# Altium project 2016_FDP.PrjPcb (part 2 of 2)

## Sheet 2016_FDP_ACTIONNEUR.SchDoc
size A2
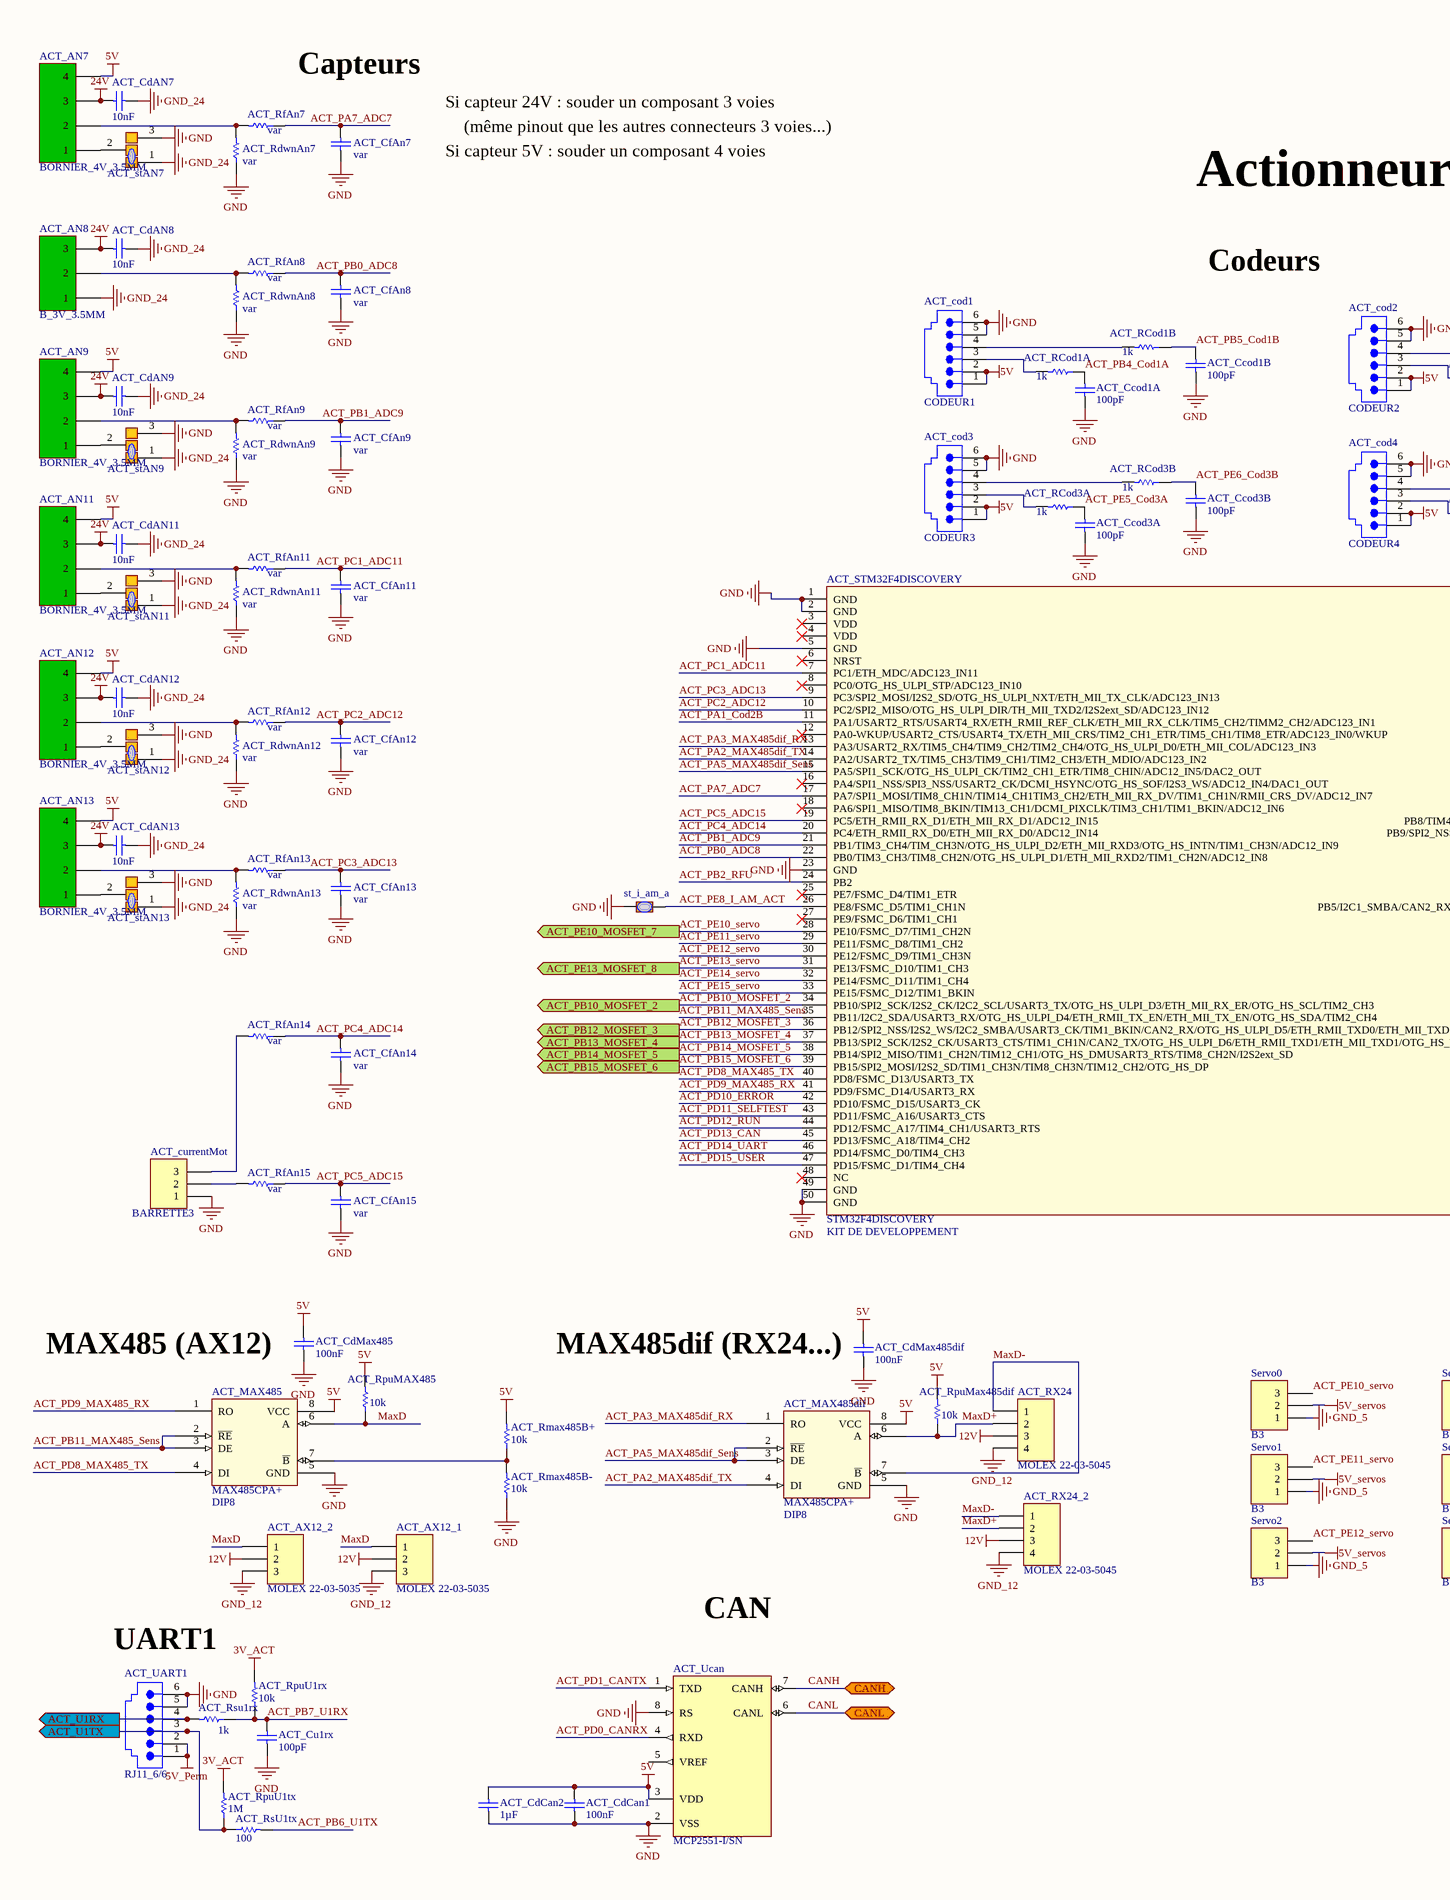
[diagram p5: 2016_FDP_ACTIONNEUR.SchDoc, left]
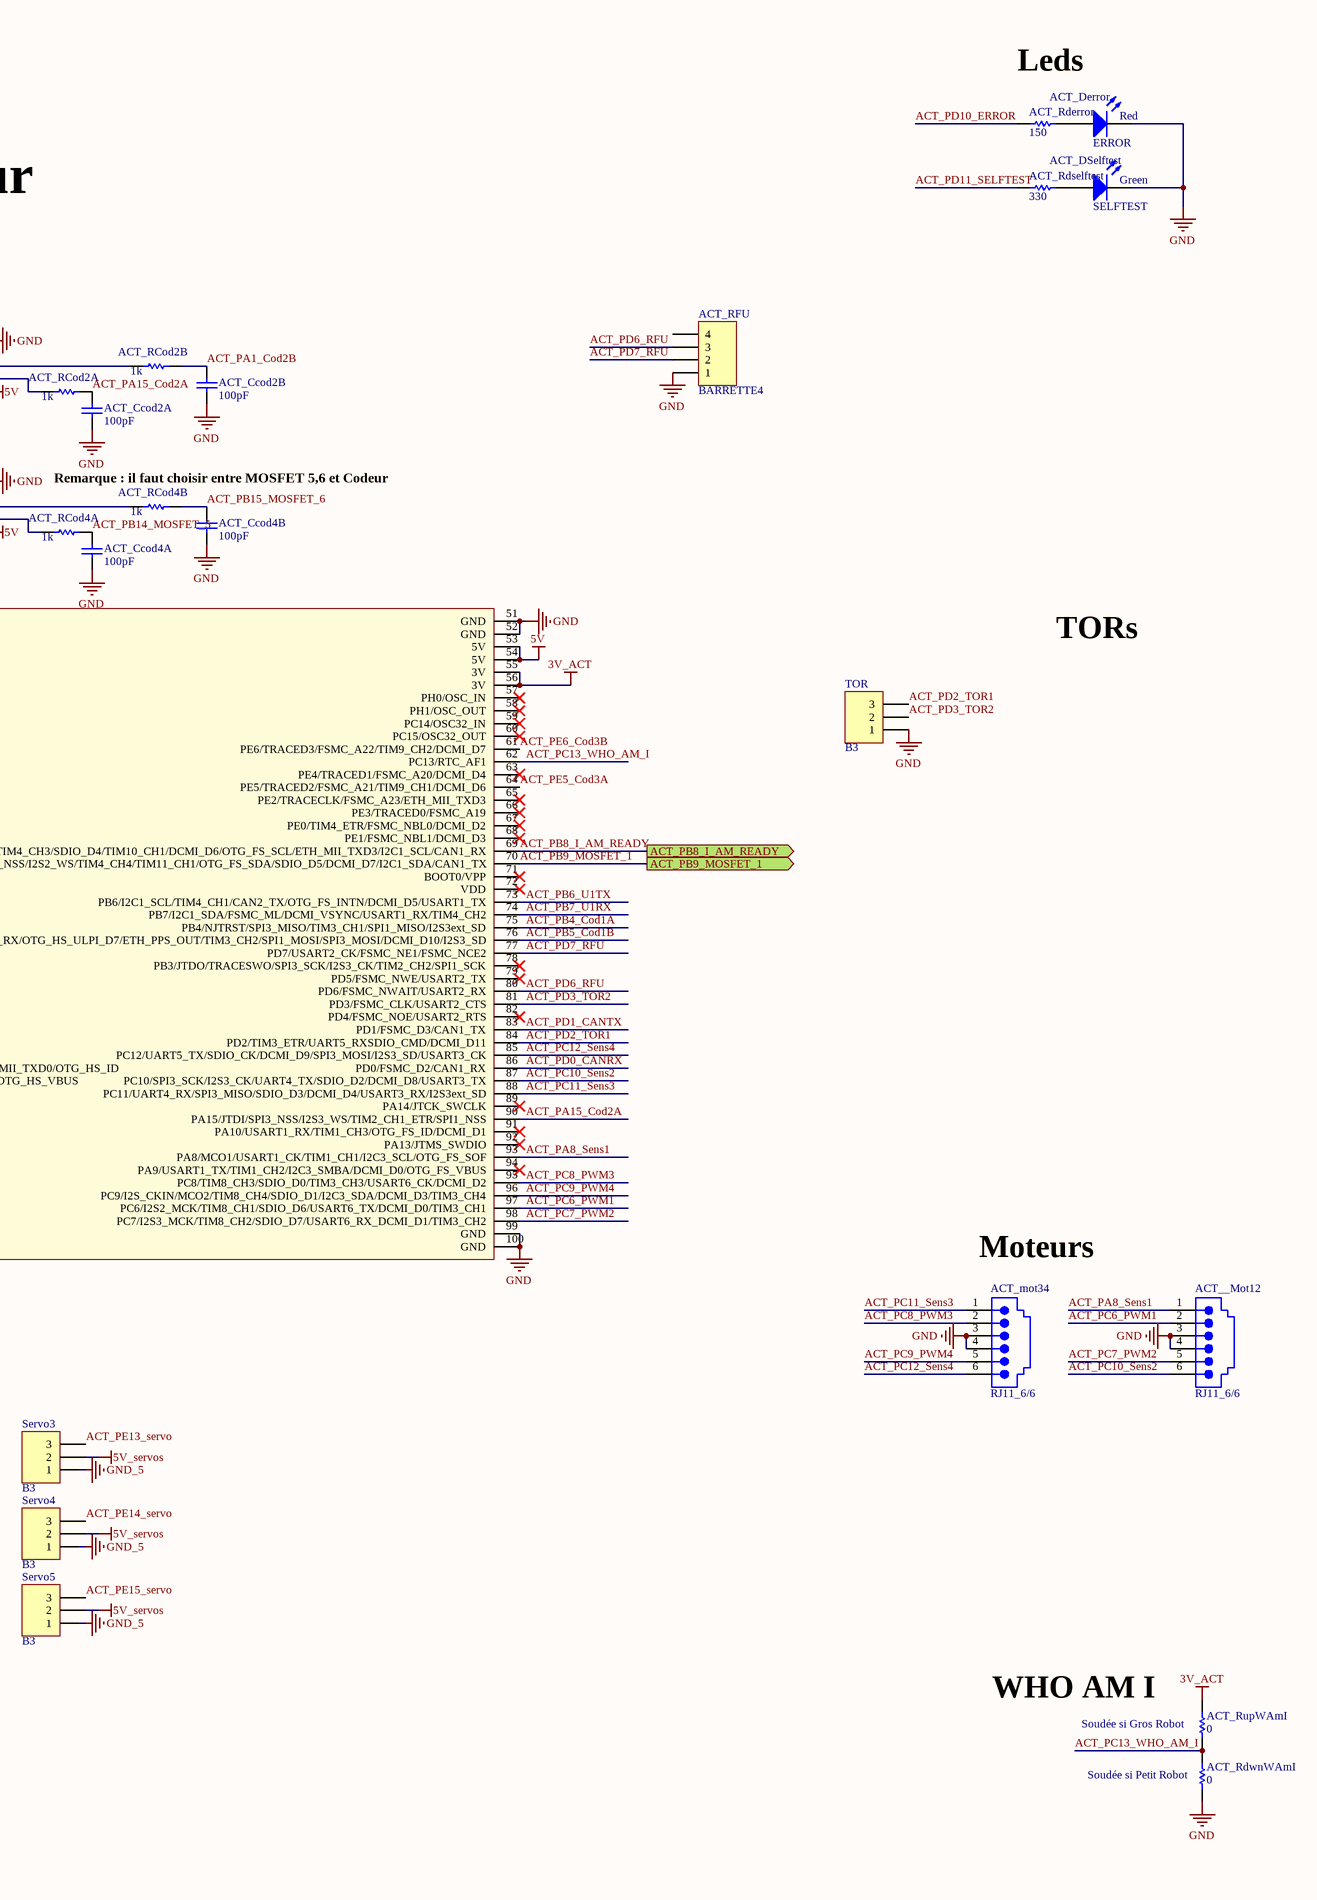
[diagram p6: 2016_FDP_ACTIONNEUR.SchDoc, right]

### Parts
ACT__Mot12  RJ11_6/6  [RJ11_6/6 - droit]
ACT_AN7  BORNIER_4V_3.5MM  [BORNIER_4V_3.5MM]
ACT_AN8  B_3V_3.5MM  [BORNIER_3V_3.5MM]
ACT_AN9  BORNIER_4V_3.5MM  [BORNIER_4V_3.5MM]
ACT_AN11  BORNIER_4V_3.5MM  [BORNIER_4V_3.5MM]
ACT_AN12  BORNIER_4V_3.5MM  [BORNIER_4V_3.5MM]
ACT_AN13  BORNIER_4V_3.5MM  [BORNIER_4V_3.5MM]
ACT_AX12_1  MOLEX 22-03-5035  [MOLEX3_2.5MM]
ACT_AX12_2  MOLEX 22-03-5035  [MOLEX3_2.5MM]
ACT_Ccod1A  100pF  [C0805_N]
ACT_Ccod1B  100pF  [C0805_N]
ACT_Ccod2A  100pF  [C0805_N]
ACT_Ccod2B  100pF  [C0805_N]
ACT_Ccod3A  100pF  [C0805_N]
ACT_Ccod3B  100pF  [C0805_N]
ACT_Ccod4A  100pF  [C0805_N]
ACT_Ccod4B  100pF  [C0805_N]
ACT_CdAN7  10nF  [C0805_N]
ACT_CdAN8  10nF  [C0805_N]
ACT_CdAN9  10nF  [C0805_N]
ACT_CdAN11  10nF  [C0805_N]
ACT_CdAN12  10nF  [C0805_N]
ACT_CdAN13  10nF  [C0805_N]
ACT_CdCan1  100nF  [C0805_N]
ACT_CdCan2  1µF  [C0805_N]
ACT_CdMax485  100nF  [C0805_N]
ACT_CdMax485dif  100nF  [C0805_N]
ACT_CfAn7  var  [C0805_N]
ACT_CfAn8  var  [C0805_N]
ACT_CfAn9  var  [C0805_N]
ACT_CfAn11  var  [C0805_N]
ACT_CfAn12  var  [C0805_N]
ACT_CfAn13  var  [C0805_N]
ACT_CfAn14  var  [C0805_N]
ACT_CfAn15  var  [C0805_N]
ACT_cod1  CODEUR1  [RJ11_6/6 - droit]
ACT_cod2  CODEUR2  [RJ11_6/6 - droit]
ACT_cod3  CODEUR3  [RJ11_6/6 - droit]
ACT_cod4  CODEUR4  [RJ11_6/6 - droit]
ACT_Cu1rx  100pF  [C0805_N]
ACT_currentMot  BARRETTE3  [HE14_3]
ACT_Derror  ERROR  [LED_0805]
ACT_DSelftest  SELFTEST  [LED_0805]
ACT_MAX485  Type: MAX485CPA+  Package: DIP8  [SO8_N]  (hidden comment: MAX485CPA+_DIP8)
ACT_MAX485dif  Type: MAX485CPA+  Package: DIP8  [SO8_N]  (hidden comment: MAX485CPA+_DIP8)
ACT_mot34  RJ11_6/6  [RJ11_6/6 - droit]
ACT_RCod1A  1k  [R1206_N]
ACT_RCod1B  1k  [R1206_N]
ACT_RCod2A  1k  [R1206_N]
ACT_RCod2B  1k  [R1206_N]
ACT_RCod3A  1k  [R1206_N]
ACT_RCod3B  1k  [R1206_N]
ACT_RCod4A  1k  [R1206_N]
ACT_RCod4B  1k  [R1206_N]
ACT_Rderror  150  [R1206_N]
ACT_Rdselftest  330  [R1206_N]
ACT_RdwnAn7  var  [R1206_N]
ACT_RdwnAn8  var  [R1206_N]
ACT_RdwnAn9  var  [R1206_N]
ACT_RdwnAn11  var  [R1206_N]
ACT_RdwnAn12  var  [R1206_N]
ACT_RdwnAn13  var  [R1206_N]
ACT_RdwnWAmI  0  [R1206_N]
ACT_RfAn7  var  [R1206_N]
ACT_RfAn8  var  [R1206_N]
ACT_RfAn9  var  [R1206_N]
ACT_RfAn11  var  [R1206_N]
ACT_RfAn12  var  [R1206_N]
ACT_RfAn13  var  [R1206_N]
ACT_RfAn14  var  [R1206_N]
ACT_RfAn15  var  [R1206_N]
ACT_RFU  BARRETTE4  [HE14_4]
ACT_Rmax485B+  10k  [R1206_N]
ACT_Rmax485B-  10k  [R1206_N]
ACT_RpuMAX485  10k  [R1206_N]
ACT_RpuMax485dif  10k  [R1206_N]
ACT_RpuU1rx  10k  [R1206_N]
ACT_RpuU1tx  1M  [R1206_N]
ACT_Rsu1rx  1k  [R1206_N]
ACT_RsU1tx  100  [R1206_N]
ACT_RupWAmI  0  [R1206_N]
ACT_RX24  MOLEX 22-03-5045  [MOLEX4_2.5MM]
ACT_RX24_2  MOLEX 22-03-5045  [MOLEX4_2.5MM]
ACT_stAN7  strap  [Goutte Strap_3]  (value not drawn)
ACT_stAN9  strap  [Goutte Strap_3]  (value not drawn)
ACT_stAN11  strap  [Goutte Strap_3]  (value not drawn)
ACT_stAN12  strap  [Goutte Strap_3]  (value not drawn)
ACT_stAN13  strap  [Goutte Strap_3]  (value not drawn)
ACT_STM32F4DISCOVERY  STM32F4DISCOVERY  Type: KIT DE DEVELOPPEMENT  [STM32_F4DISCOVERY]
ACT_UART1  RJ11_6/6  [RJ11_6/6 - droit]
ACT_Ucan  MCP2551-I/SN  [SO8_N]
Servo0  B3  [HE14_3]
Servo1  B3  [HE14_3]
Servo2  B3  [HE14_3]
Servo3  B3  [HE14_3]
Servo4  B3  [HE14_3]
Servo5  B3  [HE14_3]
st_i_am_a  Goutte Strap_2  [Goutte Strap_2 Pads_Clearance 0.254mm]  (value not drawn)
TOR  B3  [HE14_3]

### Ports
ACT_PB8_I_AM_READY (out), ACT_PB9_MOSFET_1 (out), ACT_PB10_MOSFET_2 (out), ACT_PB12_MOSFET_3 (out), ACT_PB13_MOSFET_4 (out), ACT_PB14_MOSFET_5 (out), ACT_PB15_MOSFET_6 (out), ACT_PE10_MOSFET_7 (out), ACT_PE13_MOSFET_8 (out), ACT_U1RX (out), ACT_U1TX (out), CANH (bidir), CANL (bidir)

### Nets
3V_ACT: ACT_RpuU1rx.2 ACT_RpuU1tx.2 ACT_RupWAmI.2 ACT_STM32F4DISCOVERY.55(3V) ACT_STM32F4DISCOVERY.56(3V)
5V: ACT_AN7.4 ACT_AN9.4 ACT_AN11.4 ACT_AN12.4 ACT_AN13.4 ACT_CdCan1.2 ACT_CdCan2.2 ACT_CdMax485.2 ACT_CdMax485dif.2 ACT_cod1.1 ACT_cod1.2 ACT_cod2.1 ACT_cod2.2 ACT_cod3.1 ACT_cod3.2 ACT_cod4.1 ACT_cod4.2 ACT_MAX485.8(VCC) ACT_MAX485dif.8(VCC) ACT_Rmax485B+.2 ACT_RpuMAX485.2 ACT_RpuMax485dif.2 ACT_STM32F4DISCOVERY.53(5V) ACT_STM32F4DISCOVERY.54(5V) ACT_Ucan.3(VDD)
5V_Perm: ACT_UART1.1 ACT_UART1.2
5V_servos: Servo0.2 Servo1.2 Servo2.2 Servo3.2 Servo4.2 Servo5.2
12V: ACT_AX12_1.2 ACT_AX12_2.2 ACT_RX24.3 ACT_RX24_2.3
24V: ACT_AN7.3 ACT_AN8.3 ACT_AN9.3 ACT_AN11.3 ACT_AN12.3 ACT_AN13.3 ACT_CdAN7.2 ACT_CdAN8.2 ACT_CdAN9.2 ACT_CdAN11.2 ACT_CdAN12.2 ACT_CdAN13.2
GND: ACT__Mot12.3 ACT__Mot12.4 ACT_Ccod1A.1 ACT_Ccod1B.1 ACT_Ccod2A.1 ACT_Ccod2B.1 ACT_Ccod3A.1 ACT_Ccod3B.1 ACT_Ccod4A.1 ACT_Ccod4B.1 ACT_CdCan1.1 ACT_CdCan2.1 ACT_CdMax485.1 ACT_CdMax485dif.1 ACT_CfAn7.1 ACT_CfAn8.1 ACT_CfAn9.1 ACT_CfAn11.1 ACT_CfAn12.1 ACT_CfAn13.1 ACT_CfAn14.1 ACT_CfAn15.1 ACT_cod1.5 ACT_cod1.6 ACT_cod2.5 ACT_cod2.6 ACT_cod3.5 ACT_cod3.6 ACT_cod4.5 ACT_cod4.6 ACT_Cu1rx.1 ACT_currentMot.1 ACT_Derror.2(K) ACT_DSelftest.2(K) ACT_MAX485.5(GND) ACT_MAX485dif.5(GND) ACT_mot34.3 ACT_mot34.4 ACT_RdwnAn7.1 ACT_RdwnAn8.1 ACT_RdwnAn9.1 ACT_RdwnAn11.1 ACT_RdwnAn12.1 ACT_RdwnAn13.1 ACT_RdwnWAmI.1 ACT_RFU.1 ACT_Rmax485B-.1 ACT_stAN7.3 ACT_stAN9.3 ACT_stAN11.3 ACT_stAN12.3 ACT_stAN13.3 ACT_STM32F4DISCOVERY.1(GND) ACT_STM32F4DISCOVERY.2(GND) ACT_STM32F4DISCOVERY.5(GND) ACT_STM32F4DISCOVERY.23(GND) ACT_STM32F4DISCOVERY.49(GND) ACT_STM32F4DISCOVERY.50(GND) ACT_STM32F4DISCOVERY.51(GND) ACT_STM32F4DISCOVERY.52(GND) ACT_STM32F4DISCOVERY.99(GND) ACT_STM32F4DISCOVERY.100(GND) ACT_UART1.5 ACT_UART1.6 ACT_Ucan.2(VSS) ACT_Ucan.8(RS) st_i_am_a.1 TOR.1
GND_5: Servo0.1 Servo1.1 Servo2.1 Servo3.1 Servo4.1 Servo5.1
GND_12: ACT_AX12_1.3 ACT_AX12_2.3 ACT_RX24.4 ACT_RX24_2.4
GND_24: ACT_AN8.1 ACT_CdAN7.1 ACT_CdAN8.1 ACT_CdAN9.1 ACT_CdAN11.1 ACT_CdAN12.1 ACT_CdAN13.1 ACT_stAN7.1 ACT_stAN9.1 ACT_stAN11.1 ACT_stAN12.1 ACT_stAN13.1
ACT_PA1_Cod2B: ACT_Ccod2B.2 ACT_RCod2B.1 ACT_STM32F4DISCOVERY.11(PA1/USART2_RTS/USART4_RX/ETH_RMII_REF_CLK/ETH_MII_RX_CLK/TIM5_CH2/TIMM2_CH2/ADC123_IN1)
ACT_PA2_MAX485dif_TX: ACT_MAX485dif.4(DI) ACT_STM32F4DISCOVERY.14(PA2/USART2_TX/TIM5_CH3/TIM9_CH1/TIM2_CH3/ETH_MDIO/ADC123_IN2)
ACT_PA3_MAX485dif_RX: ACT_MAX485dif.1(RO) ACT_STM32F4DISCOVERY.13(PA3/USART2_RX/TIM5_CH4/TIM9_CH2/TIM2_CH4/OTG_HS_ULPI_D0/ETH_MII_COL/ADC123_IN3)
ACT_PA5_MAX485dif_Sens: ACT_MAX485dif.2(~{RE}) ACT_MAX485dif.3(DE) ACT_STM32F4DISCOVERY.15(PA5/SPI1_SCK/OTG_HS_ULPI_CK/TIM2_CH1_ETR/TIM8_CHIN/ADC12_IN5/DAC2_OUT)
ACT_PA7_ADC7: ACT_CfAn7.2 ACT_RfAn7.1 ACT_STM32F4DISCOVERY.17(PA7/SPI1_MOSI/TIM8_CH1N/TIM14_CH1TIM3_CH2/ETH_MII_RX_DV/TIM1_CH1N/RMII_CRS_DV/ADC12_IN7)
ACT_PA8_Sens1: ACT__Mot12.1 ACT_STM32F4DISCOVERY.93(PA8/MCO1/USART1_CK/TIM1_CH1/I2C3_SCL/OTG_FS_SOF)
ACT_PA15_Cod2A: ACT_Ccod2A.2 ACT_RCod2A.1 ACT_STM32F4DISCOVERY.90(PA15/JTDI/SPI3_NSS/I2S3_WS/TIM2_CH1_ETR/SPI1_NSS)
ACT_PB0_ADC8: ACT_CfAn8.2 ACT_RfAn8.1 ACT_STM32F4DISCOVERY.22(PB0/TIM3_CH3/TIM8_CH2N/OTG_HS_ULPI_D1/ETH_MII_RXD2/TIM1_CH2N/ADC12_IN8)
ACT_PB1_ADC9: ACT_CfAn9.2 ACT_RfAn9.1 ACT_STM32F4DISCOVERY.21(PB1/TIM3_CH4/TIM_CH3N/OTG_HS_ULPI_D2/ETH_MII_RXD3/OTG_HS_INTN/TIM1_CH3N/ADC12_IN9)
ACT_PB2_RFU: ACT_STM32F4DISCOVERY.24(PB2)
ACT_PB4_Cod1A: ACT_Ccod1A.2 ACT_RCod1A.1 ACT_STM32F4DISCOVERY.75(PB4/NJTRST/SPI3_MISO/TIM3_CH1/SPI1_MISO/I2S3ext_SD)
ACT_PB5_Cod1B: ACT_Ccod1B.2 ACT_RCod1B.1 ACT_STM32F4DISCOVERY.76(PB5/I2C1_SMBA/CAN2_RX/OTG_HS_ULPI_D7/ETH_PPS_OUT/TIM3_CH2/SPI1_MOSI/SPI3_MOSI/DCMI_D10/I2S3_SD)
ACT_PB6_U1TX: ACT_RsU1tx.2 ACT_STM32F4DISCOVERY.73(PB6/I2C1_SCL/TIM4_CH1/CAN2_TX/OTG_FS_INTN/DCMI_D5/USART1_TX)
ACT_PB7_U1RX: ACT_Cu1rx.2 ACT_RpuU1rx.1 ACT_Rsu1rx.1 ACT_STM32F4DISCOVERY.74(PB7/I2C1_SDA/FSMC_ML/DCMI_VSYNC/USART1_RX/TIM4_CH2)
ACT_PB8_I_AM_READY: ACT_STM32F4DISCOVERY.69(PB8/TIM4_CH3/SDIO_D4/TIM10_CH1/DCMI_D6/OTG_FS_SCL/ETH_MII_TXD3/I2C1_SCL/CAN1_RX) ; port ACT_PB8_I_AM_READY
ACT_PB9_MOSFET_1: ACT_STM32F4DISCOVERY.70(PB9/SPI2_NSS/I2S2_WS/TIM4_CH4/TIM11_CH1/OTG_FS_SDA/SDIO_D5/DCMI_D7/I2C1_SDA/CAN1_TX) ; port ACT_PB9_MOSFET_1
ACT_PB10_MOSFET_2: ACT_STM32F4DISCOVERY.34(PB10/SPI2_SCK/I2S2_CK/I2C2_SCL/USART3_TX/OTG_HS_ULPI_D3/ETH_MII_RX_ER/OTG_HS_SCL/TIM2_CH3) ; port ACT_PB10_MOSFET_2
ACT_PB11_MAX485_Sens: ACT_MAX485.2(~{RE}) ACT_MAX485.3(DE) ACT_STM32F4DISCOVERY.35(PB11/I2C2_SDA/USART3_RX/OTG_HS_ULPI_D4/ETH_RMII_TX_EN/ETH_MII_TX_EN/OTG_HS_SDA/TIM2_CH4)
ACT_PB12_MOSFET_3: ACT_STM32F4DISCOVERY.36(PB12/SPI2_NSS/I2S2_WS/I2C2_SMBA/USART3_CK/TIM1_BKIN/CAN2_RX/OTG_HS_ULPI_D5/ETH_RMII_TXD0/ETH_MII_TXD0/OTG_HS_ID) ; port ACT_PB12_MOSFET_3
ACT_PB13_MOSFET_4: ACT_STM32F4DISCOVERY.37(PB13/SPI2_SCK/I2S2_CK/USART3_CTS/TIM1_CH1N/CAN2_TX/OTG_HS_ULPI_D6/ETH_RMII_TXD1/ETH_MII_TXD1/OTG_HS_VBUS) ; port ACT_PB13_MOSFET_4
ACT_PB14_MOSFET_5: ACT_Ccod4A.2 ACT_RCod4A.1 ACT_STM32F4DISCOVERY.38(PB14/SPI2_MISO/TIM1_CH2N/TIM12_CH1/OTG_HS_DMUSART3_RTS/TIM8_CH2N/I2S2ext_SD) ; port ACT_PB14_MOSFET_5
ACT_PB15_MOSFET_6: ACT_Ccod4B.2 ACT_RCod4B.1 ACT_STM32F4DISCOVERY.39(PB15/SPI2_MOSI/I2S2_SD/TIM1_CH3N/TIM8_CH3N/TIM12_CH2/OTG_HS_DP) ; port ACT_PB15_MOSFET_6
ACT_PC1_ADC11: ACT_CfAn11.2 ACT_RfAn11.1 ACT_STM32F4DISCOVERY.7(PC1/ETH_MDC/ADC123_IN11)
ACT_PC2_ADC12: ACT_CfAn12.2 ACT_RfAn12.1 ACT_STM32F4DISCOVERY.10(PC2/SPI2_MISO/OTG_HS_ULPI_DIR/TH_MII_TXD2/I2S2ext_SD/ADC123_IN12)
ACT_PC3_ADC13: ACT_CfAn13.2 ACT_RfAn13.1 ACT_STM32F4DISCOVERY.9(PC3/SPI2_MOSI/I2S2_SD/OTG_HS_ULPI_NXT/ETH_MII_TX_CLK/ADC123_IN13)
ACT_PC4_ADC14: ACT_CfAn14.2 ACT_RfAn14.1 ACT_STM32F4DISCOVERY.20(PC4/ETH_RMII_RX_D0/ETH_MII_RX_D0/ADC12_IN14)
ACT_PC5_ADC15: ACT_CfAn15.2 ACT_RfAn15.1 ACT_STM32F4DISCOVERY.19(PC5/ETH_RMII_RX_D1/ETH_MII_RX_D1/ADC12_IN15)
ACT_PC6_PWM1: ACT__Mot12.2 ACT_STM32F4DISCOVERY.97(PC6/I2S2_MCK/TIM8_CH1/SDIO_D6/USART6_TX/DCMI_D0/TIM3_CH1)
ACT_PC7_PWM2: ACT__Mot12.5 ACT_STM32F4DISCOVERY.98(PC7/I2S3_MCK/TIM8_CH2/SDIO_D7/USART6_RX_DCMI_D1/TIM3_CH2)
ACT_PC8_PWM3: ACT_mot34.2 ACT_STM32F4DISCOVERY.95(PC8/TIM8_CH3/SDIO_D0/TIM3_CH3/USART6_CK/DCMI_D2)
ACT_PC9_PWM4: ACT_mot34.5 ACT_STM32F4DISCOVERY.96(PC9/I2S_CKIN/MCO2/TIM8_CH4/SDIO_D1/I2C3_SDA/DCMI_D3/TIM3_CH4)
ACT_PC10_Sens2: ACT__Mot12.6 ACT_STM32F4DISCOVERY.87(PC10/SPI3_SCK/I2S3_CK/UART4_TX/SDIO_D2/DCMI_D8/USART3_TX)
ACT_PC11_Sens3: ACT_mot34.1 ACT_STM32F4DISCOVERY.88(PC11/UART4_RX/SPI3_MISO/SDIO_D3/DCMI_D4/USART3_RX/I2S3ext_SD)
ACT_PC12_Sens4: ACT_mot34.6 ACT_STM32F4DISCOVERY.85(PC12/UART5_TX/SDIO_CK/DCMI_D9/SPI3_MOSI/I2S3_SD/USART3_CK)
ACT_PC13_WHO_AM_I: ACT_RdwnWAmI.2 ACT_RupWAmI.1 ACT_STM32F4DISCOVERY.62(PC13/RTC_AF1)
ACT_PD0_CANRX: ACT_STM32F4DISCOVERY.86(PD0/FSMC_D2/CAN1_RX) ACT_Ucan.4(RXD)
ACT_PD1_CANTX: ACT_STM32F4DISCOVERY.83(PD1/FSMC_D3/CAN1_TX) ACT_Ucan.1(TXD)
ACT_PD2_TOR1: ACT_STM32F4DISCOVERY.84(PD2/TIM3_ETR/UART5_RXSDIO_CMD/DCMI_D11) TOR.3
ACT_PD3_TOR2: ACT_STM32F4DISCOVERY.81(PD3/FSMC_CLK/USART2_CTS) TOR.2
ACT_PD6_RFU: ACT_RFU.3 ACT_STM32F4DISCOVERY.80(PD6/FSMC_NWAIT/USART2_RX)
ACT_PD7_RFU: ACT_RFU.2 ACT_STM32F4DISCOVERY.77(PD7/USART2_CK/FSMC_NE1/FSMC_NCE2)
ACT_PD8_MAX485_TX: ACT_MAX485.4(DI) ACT_STM32F4DISCOVERY.40(PD8/FSMC_D13/USART3_TX)
ACT_PD9_MAX485_RX: ACT_MAX485.1(RO) ACT_STM32F4DISCOVERY.41(PD9/FSMC_D14/USART3_RX)
ACT_PD10_ERROR: ACT_Rderror.1 ACT_STM32F4DISCOVERY.42(PD10/FSMC_D15/USART3_CK)
ACT_PD11_SELFTEST: ACT_Rdselftest.1 ACT_STM32F4DISCOVERY.43(PD11/FSMC_A16/USART3_CTS)
ACT_PD12_RUN: ACT_STM32F4DISCOVERY.44(PD12/FSMC_A17/TIM4_CH1/USART3_RTS)
ACT_PD13_CAN: ACT_STM32F4DISCOVERY.45(PD13/FSMC_A18/TIM4_CH2)
ACT_PD14_UART: ACT_STM32F4DISCOVERY.46(PD14/FSMC_D0/TIM4_CH3)
ACT_PD15_USER: ACT_STM32F4DISCOVERY.47(PD15/FSMC_D1/TIM4_CH4)
ACT_PE5_Cod3A: ACT_Ccod3A.2 ACT_RCod3A.1 ACT_STM32F4DISCOVERY.64(PE5/TRACED2/FSMC_A21/TIM9_CH1/DCMI_D6)
ACT_PE6_Cod3B: ACT_Ccod3B.2 ACT_RCod3B.1 ACT_STM32F4DISCOVERY.61(PE6/TRACED3/FSMC_A22/TIM9_CH2/DCMI_D7)
ACT_PE8_I_AM_ACT: ACT_STM32F4DISCOVERY.26(PE8/FSMC_D5/TIM1_CH1N) st_i_am_a.2
ACT_PE10_servo: ACT_STM32F4DISCOVERY.28(PE10/FSMC_D7/TIM1_CH2N) Servo0.3 ; port ACT_PE10_MOSFET_7
ACT_PE11_servo: ACT_STM32F4DISCOVERY.29(PE11/FSMC_D8/TIM1_CH2) Servo1.3
ACT_PE12_servo: ACT_STM32F4DISCOVERY.30(PE12/FSMC_D9/TIM1_CH3N) Servo2.3
ACT_PE13_servo: ACT_STM32F4DISCOVERY.31(PE13/FSMC_D10/TIM1_CH3) Servo3.3 ; port ACT_PE13_MOSFET_8
ACT_PE14_servo: ACT_STM32F4DISCOVERY.32(PE14/FSMC_D11/TIM1_CH4) Servo4.3
ACT_PE15_servo: ACT_STM32F4DISCOVERY.33(PE15/FSMC_D12/TIM1_BKIN) Servo5.3
ACT_U1RX: ACT_Rsu1rx.2 ACT_UART1.4 ; port ACT_U1RX
ACT_U1TX: ACT_RpuU1tx.1 ACT_RsU1tx.1 ACT_UART1.3 ; port ACT_U1TX
CANH: ACT_Ucan.7(CANH) ; port CANH
CANL: ACT_Ucan.6(CANL) ; port CANL
MaxD: ACT_AX12_1.1 ACT_AX12_2.1 ACT_MAX485.6(A) ACT_RpuMAX485.1
MaxD+: ACT_MAX485dif.6(A) ACT_RpuMax485dif.1 ACT_RX24.2 ACT_RX24_2.2
MaxD-: ACT_MAX485dif.7(~{B}) ACT_RX24.1 ACT_RX24_2.1
NetACT_AN7_1: ACT_AN7.1 ACT_stAN7.2
NetACT_AN7_2: ACT_AN7.2 ACT_RdwnAn7.2 ACT_RfAn7.2
NetACT_AN8_2: ACT_AN8.2 ACT_RdwnAn8.2 ACT_RfAn8.2
NetACT_AN9_1: ACT_AN9.1 ACT_stAN9.2
NetACT_AN9_2: ACT_AN9.2 ACT_RdwnAn9.2 ACT_RfAn9.2
NetACT_AN11_1: ACT_AN11.1 ACT_stAN11.2
NetACT_AN11_2: ACT_AN11.2 ACT_RdwnAn11.2 ACT_RfAn11.2
NetACT_AN12_1: ACT_AN12.1 ACT_stAN12.2
NetACT_AN12_2: ACT_AN12.2 ACT_RdwnAn12.2 ACT_RfAn12.2
NetACT_AN13_1: ACT_AN13.1 ACT_stAN13.2
NetACT_AN13_2: ACT_AN13.2 ACT_RdwnAn13.2 ACT_RfAn13.2
NetACT_cod1_3: ACT_cod1.3 ACT_RCod1A.2
NetACT_cod1_4: ACT_cod1.4 ACT_RCod1B.2
NetACT_cod2_3: ACT_cod2.3 ACT_RCod2A.2
NetACT_cod2_4: ACT_cod2.4 ACT_RCod2B.2
NetACT_cod3_3: ACT_cod3.3 ACT_RCod3A.2
NetACT_cod3_4: ACT_cod3.4 ACT_RCod3B.2
NetACT_cod4_3: ACT_cod4.3 ACT_RCod4A.2
NetACT_cod4_4: ACT_cod4.4 ACT_RCod4B.2
NetACT_currentMot_2: ACT_currentMot.2 ACT_RfAn15.2
NetACT_currentMot_3: ACT_currentMot.3 ACT_RfAn14.2
NetACT_Derror_1: ACT_Derror.1(A) ACT_Rderror.2
NetACT_DSelftest_1: ACT_DSelftest.1(A) ACT_Rdselftest.2
NetACT_MAX485_7: ACT_MAX485.7(~{B}) ACT_Rmax485B+.1 ACT_Rmax485B-.2

Not connected (* = marked no-connect by the designer): ACT_RFU 4; ACT_STM32F4DISCOVERY 3(VDD)* 4(VDD)* 6(NRST)* 8(PC0/OTG_HS_ULPI_STP/ADC123_IN10)* 12(PA0-WKUP/USART2_CTS/USART4_TX/ETH_MII_CRS/TIM2_CH1_ETR/TIM5_CH1/TIM8_ETR/ADC123_IN0/WKUP)* 16(PA4/SPI1_NSS/SPI3_NSS/USART2_CK/DCMI_HSYNC/OTG_HS_SOF/I2S3_WS/ADC12_IN4/DAC1_OUT)* 18(PA6/SPI1_MISO/TIM8_BKIN/TIM13_CH1/DCMI_PIXCLK/TIM3_CH1/TIM1_BKIN/ADC12_IN6)* 25(PE7/FSMC_D4/TIM1_ETR)* 27(PE9/FSMC_D6/TIM1_CH1)* 48(NC)* 57(PH0/OSC_IN)* 58(PH1/OSC_OUT)* 59(PC14/OSC32_IN)* 60(PC15/OSC32_OUT)* 63(PE4/TRACED1/FSMC_A20/DCMI_D4)* 65(PE2/TRACECLK/FSMC_A23/ETH_MII_TXD3)* 66(PE3/TRACED0/FSMC_A19)* 67(PE0/TIM4_ETR/FSMC_NBL0/DCMI_D2)* 68(PE1/FSMC_NBL1/DCMI_D3)* 71(BOOT0/VPP)* 72(VDD)* 78(PB3/JTDO/TRACESWO/SPI3_SCK/I2S3_CK/TIM2_CH2/SPI1_SCK)* 79(PD5/FSMC_NWE/USART2_TX)* 82(PD4/FSMC_NOE/USART2_RTS)* 89(PA14/JTCK_SWCLK)* 91(PA10/USART1_RX/TIM1_CH3/OTG_FS_ID/DCMI_D1)* 92(PA13/JTMS_SWDIO)* 94(PA9/USART1_TX/TIM1_CH2/I2C3_SMBA/DCMI_D0/OTG_FS_VBUS)*; ACT_Ucan 5(VREF)

### Notes on the sheet
- Capteurs
- Si capteur 24V : souder un composant 3 voies
- Leds
- (near ACT_Derror) Red
- Si capteur 5V : souder un composant 4 voies
- (même pinout que les autres connecteurs 3 voies...)
- Actionneur
- (near ACT_DSelftest) Green
- Codeurs
- Remarque : il faut choisir entre MOSFET 5,6 et Codeur
- TORs
- (near ACT_mot34) Moteurs
- MAX485 (AX12)
- (near ACT_CdMax485dif) MAX485dif (RX24...)
- CAN
- WHO AM I
- (near ACT_UART1) UART1
- (near ACT_RupWAmI) Soudée si Gros Robot
- (near ACT_RdwnWAmI) Soudée si Petit Robot
- Title
- Size:
- Date:
- File:
- A2
- Number:
- Time:
- Revision:
- Sheet
- of

### Library data of the parts
ACT__Mot12 ACT_cod1-ACT_cod4 ACT_mot34 ACT_UART1 = RJ11_6/6: Right Angle, Standard Profile, Offset Latch DECconnect, Flangeless PCB Jack; Ports: 1; Positions/Loaded: Port1 - 6 Offset Latch/6; PerformanceCategory: 3; PCB_Mounting: Thru-Hole; DrillSize: Nominal, Rounded to nearest 0.05mm; PCB_Layout: Complies with Manufacturer's Recommendation.; Published: 25-Jun-2002; DatasheetDocument: 18-Dec-2001; PackageDocument: 18-Dec-2001; PackageReference: 15-43-6110; Publisher: Altium Limited; ComponentLink1Description: Manufacturer Link; ComponentLink1URL: http://www.molex.com/; ComponentLink2Description: Datasheet; ComponentLink2URL: http://www.molex.com/cmc_upload/common_files/1212003_41369catalogpage.pdf
  ACT__Mot12 ACT_mot34 ACT_UART1: Type: RJ11_6/6
ACT_AN8 = BORNIER_3V_3.5MM
ACT_AX12_1 ACT_AX12_2 ACT_currentMot Servo0-Servo5 TOR = BARRETTE3: Header, 3-Pin; LatestRevisionDate: 17-Jul-2002; LatestRevisionNote: Re-released for DXP Platform.; Publisher: Altium Limited
ACT_Ccod1A ACT_Ccod1B ACT_Ccod2A ACT_Ccod2B ACT_Ccod3A ACT_Ccod3B ACT_Ccod4A ACT_Ccod4B ACT_CdAN7-ACT_CdAN9 ACT_CdAN11-ACT_CdAN13 ACT_CdCan1 ACT_CdCan2 ACT_CdMax485 ACT_CdMax485dif ACT_CfAn7-ACT_CfAn9 ACT_CfAn11-ACT_CfAn15 ACT_Cu1rx = Condensateur: Capacitor; Published: 8-Jun-2000; LatestRevisionDate: 17-Jul-2002; LatestRevisionNote: Re-released for DXP Platform.; PackageReference: RAD-0.3; Publisher: Altium Limited
ACT_Derror ACT_DSelftest = LED: Typical LED; Published: 8-Jun-2000; LatestRevisionDate: 08-Jul-2005; LatestRevisionNote: Mech Layer 1 removed.; PackageReference: LED-1; Publisher: Altium Limited
ACT_MAX485 ACT_MAX485dif = MAX485CPA+_DIP8: EMETTEUR/RECEPTEUR FAIBLE PUISSANCE DE LIAISONS RS422/RS485 - DIP8
ACT_RCod1A ACT_RCod1B ACT_RCod2A ACT_RCod2B ACT_RCod3A ACT_RCod3B ACT_RCod4A ACT_RCod4B ACT_Rderror ACT_Rdselftest ACT_RdwnAn7-ACT_RdwnAn9 ACT_RdwnAn11-ACT_RdwnAn13 ACT_RdwnWAmI ACT_RfAn7-ACT_RfAn9 ACT_RfAn11-ACT_RfAn15 ACT_Rmax485B+ ACT_Rmax485B- ACT_RpuMAX485 ACT_RpuMax485dif ACT_RpuU1rx ACT_RpuU1tx ACT_Rsu1rx ACT_RsU1tx ACT_RupWAmI = Resistor: Published: 8-Jun-2000; LatestRevisionDate: 17-Jul-2002; LatestRevisionNote: Re-released for DXP Platform.; PackageReference: AXIAL-0.5; Publisher: Altium Limited
ACT_RFU ACT_RX24 ACT_RX24_2 = BARRETTE4: Header, 4-Pin; LatestRevisionDate: 17-Jul-2002; LatestRevisionNote: Re-released for DXP Platform.; Publisher: Altium Limited
ACT_stAN7 ACT_stAN9 ACT_stAN11-ACT_stAN13 = Goutte Strap_3: LatestRevisionDate: 25/11/09; Publisher: Damien Guitton
ACT_STM32F4DISCOVERY = STM32F4DISCOVERY: KIT DE DEVELOPPEMENT POUR MICROCONTROLEUR STM32F407VGT6
ACT_Ucan = MCP2551-I/SN: High-Speed CAN Transceiver, 8-Pin SOIC, Industrial Temperature; Published: 25/11/09; DatasheetVersion: revE, Jan-2007; PackageVersion: revAW, Oct-2008; PackageReference: SOIC-SN8; Publisher: Damien Guitton; PackageDescription: 8-Lead Plastic Small Outline (SN) - Narrow, 3.90mm Body [SOIC]; Code_JEDEC: MS-012; Code_IPC: SOIC127P600-8; ComponentLink1Description: Manufacturer Link; ComponentLink1URL: http://www.microchip.com; ComponentLink2Description: Datasheet; ComponentLink2URL: http://ww1.microchip.com/downloads/en/DeviceDoc/21667E.pdf; ComponentLink3Description: Packaging Specification; ComponentLink3URL: http://ww1.microchip.com/downloads/en/PackagingSpec/00049AW.pdf
st_i_am_a = Goutte Strap_2: LatestRevisionDate: 30/01/11; Publisher: Damien Guitton

## Nets that join several sheets
5V: 2016_FDP_SCHEMA (Alim.5 Cd_5V.2 D_BTtx.2 Dtransil.2), 2016_FDP_PROPULSION (11 pins), 2016_FDP_STRATEGIE (9 pins), 2016_FDP_ACTIONNEUR (25 pins)
5V_Perm: 2016_FDP_SCHEMA (5 pins), 2016_FDP_PROPULSION (PRO_UART1.1 PRO_UART1.2), 2016_FDP_STRATEGIE (STR_UART1.1 STR_UART1.2), 2016_FDP_ACTIONNEUR (ACT_UART1.1 ACT_UART1.2)
5V_servos: 2016_FDP_SCHEMA (5V_servos.2), 2016_FDP_ACTIONNEUR (6 pins)
12V: 2016_FDP_SCHEMA (12V.2), 2016_FDP_ACTIONNEUR (ACT_AX12_1.2 ACT_AX12_2.2 ACT_RX24.3 ACT_RX24_2.3)
24V: 2016_FDP_SCHEMA (Alim.2), 2016_FDP_PROPULSION (12 pins), 2016_FDP_STRATEGIE (11 pins), 2016_FDP_ACTIONNEUR (12 pins)
GND: 2016_FDP_SCHEMA (31 pins), 2016_FDP_PROPULSION (48 pins), 2016_FDP_STRATEGIE (48 pins), 2016_FDP_ACTIONNEUR (68 pins)
GND_5: 2016_FDP_SCHEMA (5V_servos.1), 2016_FDP_ACTIONNEUR (6 pins)
GND_12: 2016_FDP_SCHEMA (12V.1), 2016_FDP_ACTIONNEUR (ACT_AX12_1.3 ACT_AX12_2.3 ACT_RX24.4 ACT_RX24_2.4)
GND_24: 2016_FDP_SCHEMA (Alim.1), 2016_FDP_PROPULSION (12 pins), 2016_FDP_STRATEGIE (11 pins), 2016_FDP_ACTIONNEUR (12 pins)
ACT_PB8_I_AM_READY: 2016_FDP_SCHEMA (STR_RactRdy.2), 2016_FDP_ACTIONNEUR (ACT_STM32F4DISCOVERY.69)
ACT_U1RX: 2016_FDP_SCHEMA (ACT_JPr.2), 2016_FDP_ACTIONNEUR (ACT_Rsu1rx.2 ACT_UART1.4)
ACT_U1TX: 2016_FDP_SCHEMA (ACT_JPt.2), 2016_FDP_ACTIONNEUR (ACT_RpuU1tx.1 ACT_RsU1tx.1 ACT_UART1.3)
CANH: 2016_FDP_SCHEMA (COMRF.15 RcanH1.2 RcanH2.1), 2016_FDP_PROPULSION (PRO_Ucan.7), 2016_FDP_STRATEGIE (STR_Ucan.7), 2016_FDP_ACTIONNEUR (ACT_Ucan.7)
CANL: 2016_FDP_SCHEMA (COMRF.16 RcanL1.1 RcanL2.1), 2016_FDP_PROPULSION (PRO_Ucan.6), 2016_FDP_STRATEGIE (STR_Ucan.6), 2016_FDP_ACTIONNEUR (ACT_Ucan.6)
PRO_PB8_I_AM_READY: 2016_FDP_SCHEMA (STR_RproRdy.2), 2016_FDP_PROPULSION (PRO_STM32F4DISCOVERY.69)
PRO_U1RX: 2016_FDP_SCHEMA (PRO_JPr.2), 2016_FDP_PROPULSION (PRO_Rsu1rx.2 PRO_UART1.4)
PRO_U1TX: 2016_FDP_SCHEMA (PRO_JPt.2), 2016_FDP_PROPULSION (PRO_RpuU1tx.1 PRO_RsU1tx.1 PRO_UART1.3)
STR_IHM_SCL: 2016_FDP_SCHEMA (COMRF.14), 2016_FDP_STRATEGIE (STR_Rscl.1 STR_RTC.6 STR_STM32F4DISCOVERY.34)
STR_IHM_SDA: 2016_FDP_SCHEMA (COMRF.7), 2016_FDP_STRATEGIE (STR_Rsda.1 STR_RTC.5 STR_STM32F4DISCOVERY.35)
STR_PA2_XBEE_TX: 2016_FDP_SCHEMA (COMRF.5), 2016_FDP_STRATEGIE (STR_STM32F4DISCOVERY.14)
STR_PA3_XBEE_RX: 2016_FDP_SCHEMA (COMRF.6), 2016_FDP_STRATEGIE (STR_STM32F4DISCOVERY.13)
STR_PA5_RF_XBEE_RESET: 2016_FDP_SCHEMA (COMRF.8 COMRF.10), 2016_FDP_STRATEGIE (STR_STM32F4DISCOVERY.15)
STR_PA6_RF_Config: 2016_FDP_SCHEMA (COMRF.11), 2016_FDP_STRATEGIE (STR_STM32F4DISCOVERY.18)
STR_PC8_SynchroBalise: 2016_FDP_SCHEMA (COMRF.13), 2016_FDP_STRATEGIE (STR_STM32F4DISCOVERY.95)
STR_PD8_RF_TX: 2016_FDP_SCHEMA (COMRF.9), 2016_FDP_STRATEGIE (STR_STM32F4DISCOVERY.40)
STR_PD9_RF_RX: 2016_FDP_SCHEMA (COMRF.12), 2016_FDP_STRATEGIE (STR_STM32F4DISCOVERY.41)
STR_PE8_ACT_IS_READY: 2016_FDP_SCHEMA (STR_RactRdy.1), 2016_FDP_STRATEGIE (STR_STM32F4DISCOVERY.26)
STR_PE9_PROP_IS_READY: 2016_FDP_SCHEMA (STR_RproRdy.1), 2016_FDP_STRATEGIE (STR_STM32F4DISCOVERY.27)
STR_PE10_PROP_IS_READY: 2016_FDP_SCHEMA (STR_RihmRdy.1), 2016_FDP_STRATEGIE (STR_STM32F4DISCOVERY.28)
STR_U1RX: 2016_FDP_SCHEMA (STR_JPr.2), 2016_FDP_STRATEGIE (STR_Rsu1rx.2 STR_UART1.4)
STR_U1TX: 2016_FDP_SCHEMA (STR_JPt.2), 2016_FDP_STRATEGIE (STR_RpuU1tx.1 STR_RsU1tx.1 STR_UART1.3)